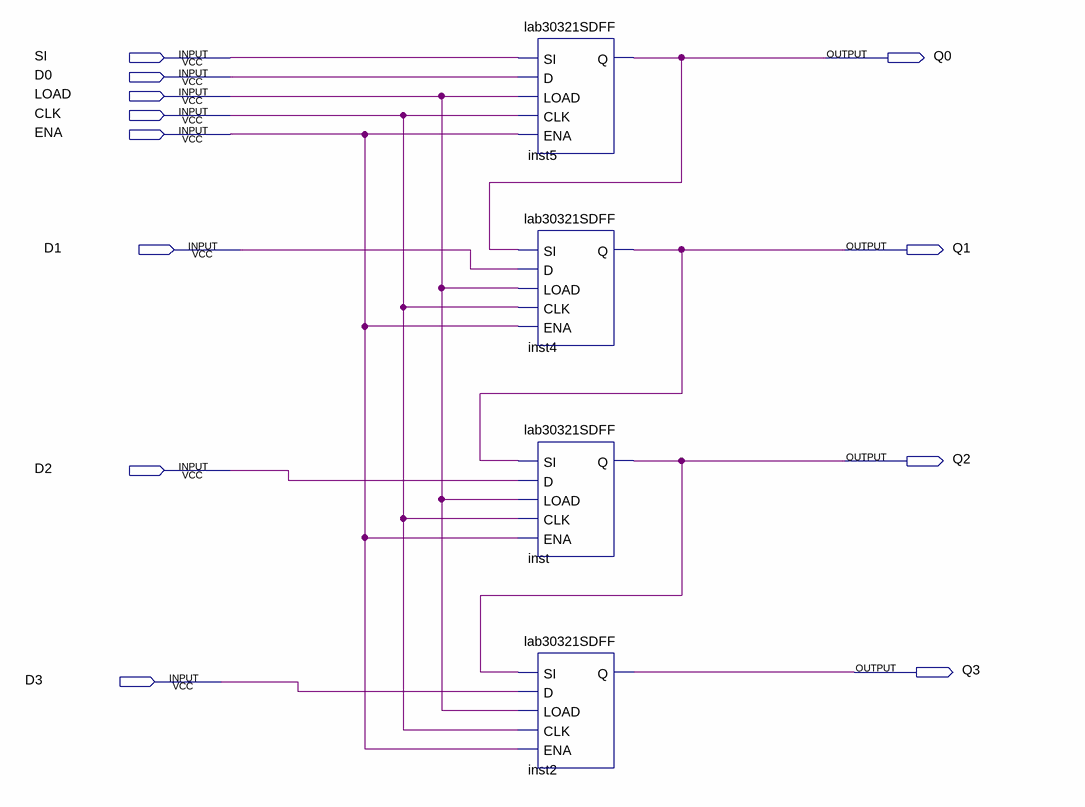
[diagram p0: schematic sheet]
// Quartus schematic lab304SPPS_ShirtReg.bdf as structural Verilog: 4 symbols, 12 pins
module lab304SPPS_ShirtReg (
  input  SI,
  input  D0,
  input  LOAD,
  input  CLK,
  input  ENA,
  input  D1,
  input  D2,
  input  D3,
  output Q0,
  output Q1,
  output Q2,
  output Q3
);

  lab30321SDFF inst5 (.SI(SI), .D(D0), .LOAD(LOAD), .CLK(CLK), .ENA(ENA), .Q(Q0));
  lab30321SDFF inst4 (.SI(Q0), .D(D1), .LOAD(LOAD), .CLK(CLK), .ENA(ENA), .Q(Q1));
  lab30321SDFF inst (.SI(Q1), .D(D2), .LOAD(LOAD), .CLK(CLK), .ENA(ENA), .Q(Q2));
  lab30321SDFF inst2 (.SI(Q2), .D(D3), .LOAD(LOAD), .CLK(CLK), .ENA(ENA), .Q(Q3));
endmodule
